# Altium schematic sheet WT2_Power.SchDoc
size A4
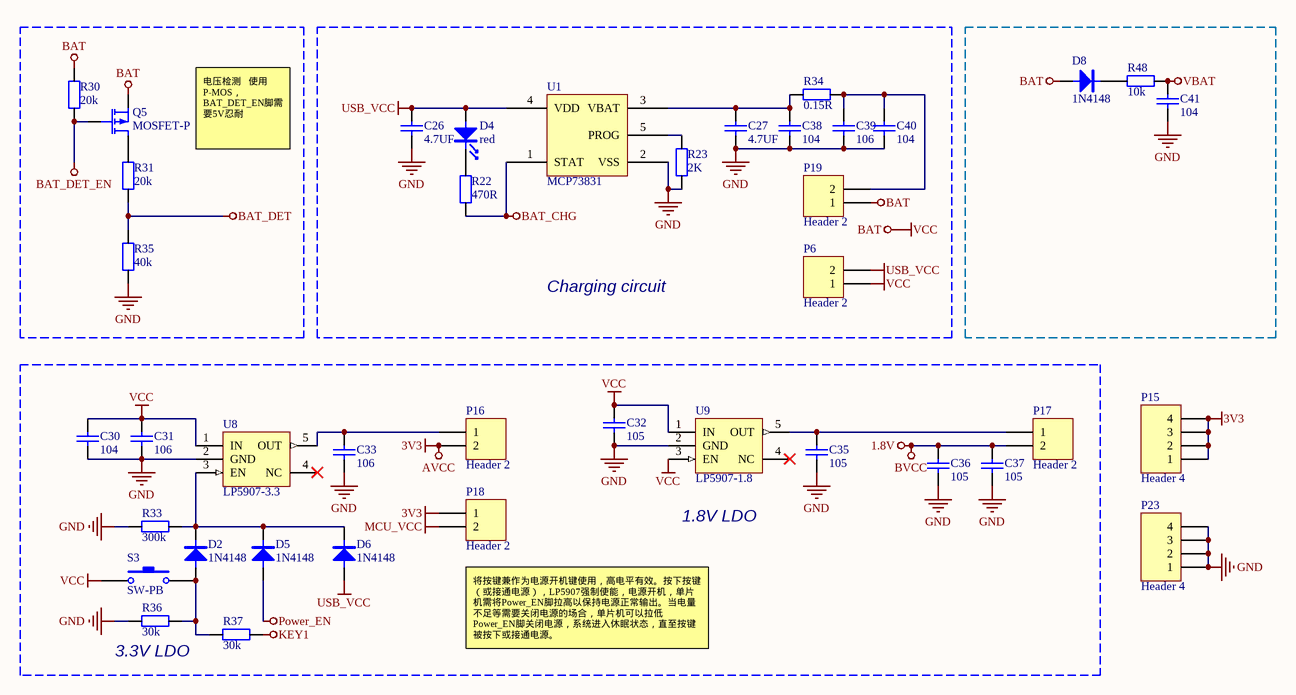
[diagram p0: WT2_Power.SchDoc]

## Parts
C26  4.7UF  [电容_C0805]
C27  4.7UF  [电容_C0805]
C30  104  [电容_C0603]
C31  106  [电容_C0603]
C32  105  [电容_C0603]
C33  106  [电容_C0603]
C35  105  [电容_C0603]
C36  105  [电容_C0603]
C37  105  [电容_C0603]
C38  104  [电容_C0603]
C39  106  [电容_C0805]
C40  104  [电容_C0603]
C41  104  [电容_C0603]
D2  1N4148  [二极管_SOD-323]
D4  red  [LED_0603]
D5  1N4148  [二极管_SOD-323]
D6  1N4148  [二极管_SOD-323]
D8  1N4148  [二极管_SOD-323]
P6  Header 2  [HDR1X2]
P15  Header 4  [HDR1X4]
P16  Header 2  [HDR1X2]
P17  Header 2  [HDR1X2]
P18  Header 2  [HDR1X2]
P19  Header 2  [HDR1X2]
P23  Header 4  [HDR1X4]
Q5  MOSFET-P  [SOT23]
R22  470R  [电阻_R0603]
R23  2K  [电阻_R0603]
R30  20k  [电阻_R0603]
R31  20k  [电阻_R0603]
R33  300k  [电阻_R0603]
R34  0.15R  [电阻_R0603]
R35  40k  [电阻_R0603]
R36  30k  [电阻_R0603]
R37  30k  [电阻_R0603]
R48  10k  [电阻_R0603]
S3  SW-PB  [KEY_6*6mm]
U1  MCP73831  [SOT23-5]
U8  LP5907-3.3  [SOT23-5]
U9  LP5907-1.8  [SOT23-5]

## Blocks framed on the sheet
Charging circuit: C26 C27 C38-C40 D4 P6 P19 R22 R23 R34 U1

## Nets
1.8V: C36.2 C37.2 P17.2  [also labelled BVCC]
3V3: P15.1 P15.2 P15.3 P15.4 P16.2 P18.1  [also labelled AVCC]
BAT: C30.2 C31.2 C32.2 D8.A P6.1 P19.1 Q5.3(S) R30.2 S3.1 U8.1(IN) U9.1(IN) U9.3(EN)  [also labelled VCC]
BAT_CHG: R22.1 U1.1(STAT)
BAT_DET: R31.1 R35.2
BAT_DET_EN: Q5.1(G) R30.1
GND: C26.1 C27.1 C30.1 C31.1 C32.1 C33.1 C35.1 C36.1 C37.1 C38.2 C39.1 C40.2 C41.2 P23.1 P23.2 P23.3 P23.4 R23.1 R33.2 R35.1 R36.2 U1.2(VSS) U8.2(GND) U9.2(GND)
KEY1: R37.1
MCU_VCC: P18.2
Power_EN: D5.A
USB_VCC: C26.2 D4.A D6.A P6.2 U1.4(VDD)
VBAT: C41.1 R48.1
NetC27_2: C27.2 C38.1 R34.2 U1.3(VBAT)
NetC33_2: C33.2 P16.1 U8.5(OUT)
NetC35_2: C35.2 P17.1 U9.5(OUT)
NetC39_2: C39.2 C40.1 P19.2 R34.1
NetD2_A: D2.A R36.1 R37.2 S3.2
NetD2_K: D2.K D5.K D6.K R33.1 U8.3(EN)
NetD4_K: D4.K R22.2
NetD8_K: D8.K R48.2
NetQ5_2: Q5.2(D) R31.2
NetR23_2: R23.2 U1.5(PROG)

Not connected (* = marked no-connect by the designer): U8 4(NC)*; U9 4(NC)*

## Notes on the sheet
- 电压检测   使用P-MOS，BAT_DET_EN脚需要5V忍耐
- (near U9) 1.8V LDO
- (near P18) 将按键兼作为电源开机键使用，高电平有效。按下按键（或接通电源），LP5907强制使能，电源开机，单片机需将Power_EN脚拉高以保持电源正常输出。当电量不足等需要关闭电源的场合，单片机可以拉低Power_EN脚关闭电源，系统进入休眠状态，直至按键被按下或接通电源。
- (near R36) 3.3V LDO

## Library data of the parts
C26 C27 C30-C33 C35-C41 = cap: U: 50V; 参数: Cap,0805,X7R,104K,50V,125C,±10%
  C26 C27: C: 4.7UF
  C30 C38 C40 C41: C: 104
  C31 C33 C39: C: 106
  C32 C35-C37: C: 105
D2 D5 D6 D8 = Diode: _Specification: Diode,1N4148,SOD-323,1A,40V; _Comma: ,; _Footprint: SOD-323; _Voltage: 40V; _Current: 1A; _Name: Diode; _Model: 1N4148
D4 = LED: 参数: LED,0603,Red
P6 P16-P19 = Header 2: Header, 2-Pin; LatestRevisionDate: 17-Jul-2002; LatestRevisionNote: Re-released for DXP Platform.; Publisher: Altium Limited
P15 P23 = Header 4: Header, 4-Pin; LatestRevisionDate: 17-Jul-2002; LatestRevisionNote: Re-released for DXP Platform.; Publisher: Altium Limited
Q5 = MOSFET-P: P-Channel MOSFET; Published: 8-Jun-2000; LatestRevisionDate: 17-Jul-2002; LatestRevisionNote: Re-released for DXP Platform.; PackageVersion: 1995/1996; PackageReference: E3; Publisher: Altium Limited; PackageDescription: TO, Flat Index; 3 In-Line, Axial Leads; Body Dia. 4.6mm; Lead Dia. 0.5 mm (max)
R22 R23 R30 R31 R33-R37 R48 = Res: P: 1/8W; 参数: Res,0805,0R,±1%,1/8W,100ppm,155C
  R22: R: 470R
  R23: R: 2K
  R30 R31: R: 20k
  R33: R: 300k
  R34: R: 0.15R
  R35: R: 40k
  R36 R37: R: 30k
  R48: R: 10k
S3 = SW-PB: 按键
U1 = MCP73831: 线性充电管理控制器
U8 U9 = LP5907: LDO